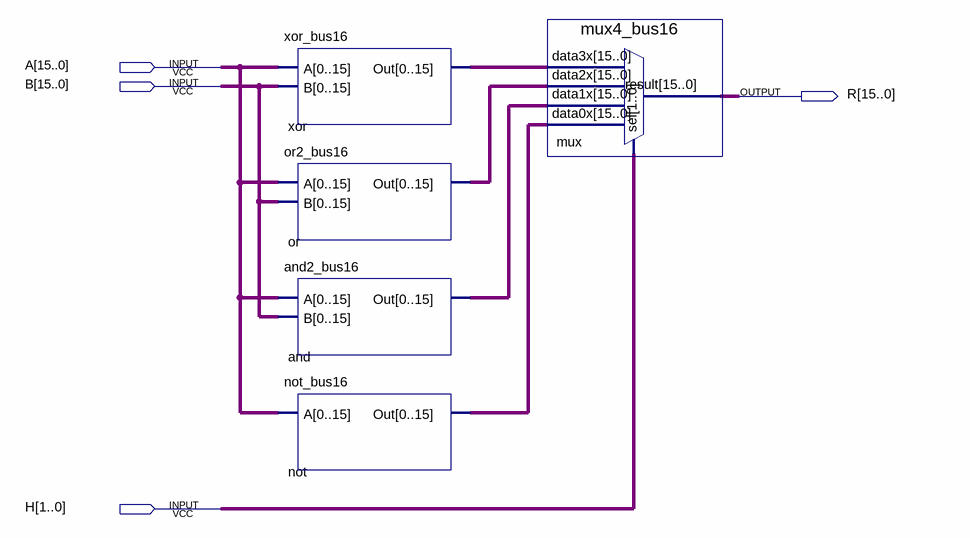
[diagram p0: schematic sheet]
// Quartus schematic logic_unit.bdf as structural Verilog: 5 symbols, 4 pins
module logic_unit (
  input  [15:0] A,
  input  [15:0] B,
  input  [1:0] H,
  output [15:0] R
);

  wire [15:0] and_out, not_out, or_out, xor_out;

  xor_bus16 \xor  (.A(A), .B(B), .Out(xor_out));
  or2_bus16 \or  (.A(A), .B(B), .Out(or_out));
  and2_bus16 \and  (.A(A), .B(B), .Out(and_out));
  not_bus16 \not  (.A(A), .Out(not_out));
  mux4_bus16 mux (.data3x(xor_out), .data2x(or_out), .data1x(and_out), .data0x(not_out), .sel(H), .result(R));
endmodule
